# EasyEDA schematic Nakuja Power.json
TITLE: Sheet_1; REV: 1.0; Date: 2022-04-21; Sheet: 1/1; Drawn By: Rodney Osodo; Company: Your Company
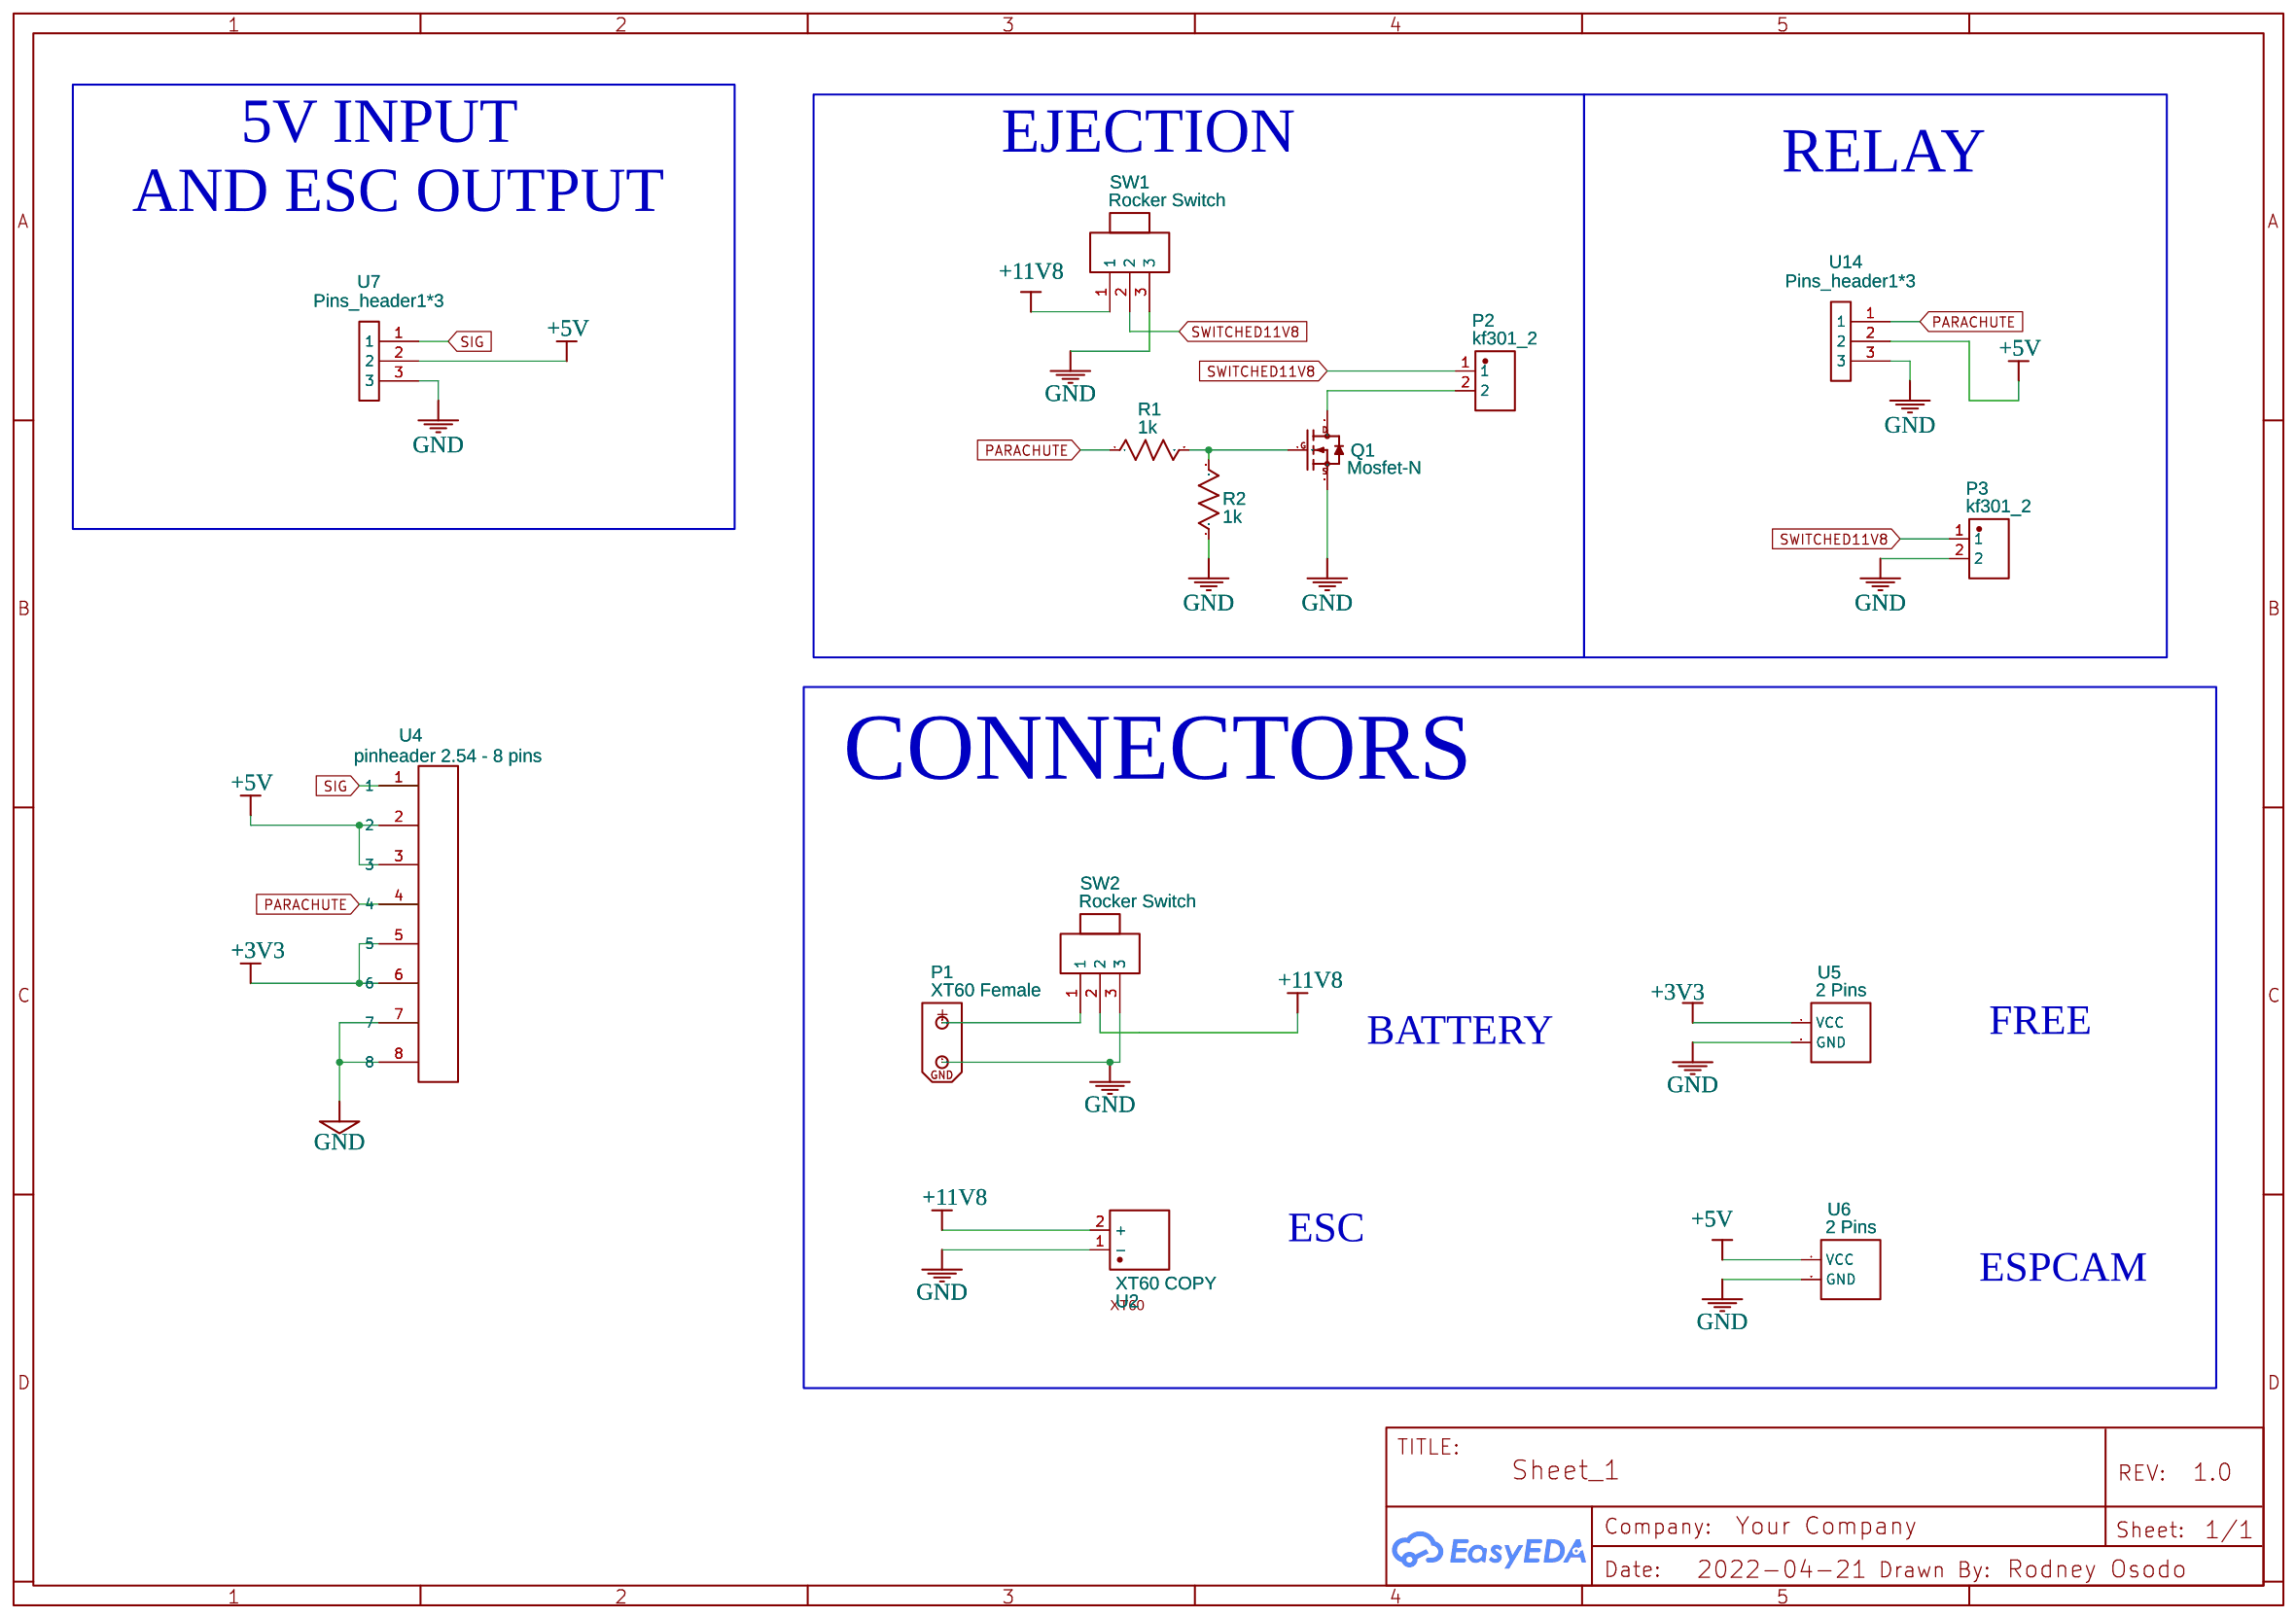
[diagram p0: schematic sheet]

## Parts
P1  XT60 Female  [XT60-F]
P2  kf301_2  [KF301_2P]
P3  kf301_2  [KF301_2P]
Q1  Mosfet-N  [DC-MOSFET-TO-220]
R1  1k  [R_AXIAL-0.6]
R2  1k  [R_AXIAL-0.6]
SW1  Rocker Switch  [ROCKER SWITCH TH]
SW2  Rocker Switch  [ROCKER SWITCH TH]
U2  XT60 COPY  [XT60]
U4  pinheader 2.54 - 8 pins  [PINHEADER 2.54 - 8 PINS]
U5  2 Pins  [2 PINS HEADER]
U6  2 Pins  [2 PINS HEADER]
U7  Pins_header1*3  [PINS_HEADER1*3]
U14  Pins_header1*3  [PINS_HEADER1*3]

## Library data of the parts
P1 = XT60 Female: Manufacturer: Changzhou Amass Elec; Contributor: rifanoz
P2 P3 = kf301_2: Manufacturer: BOOMELE; image: //image.lceda.cn/szlcsc/C33435.jpg; Supplier Part: C33435; Contributor: rusrobot
Q1 = Mosfet-N: Contributor: dina
R1 R2 = R_AXIAL-0.6_US: Contributor: LCEDA_Lib
SW1 SW2 = Rocker Switch: Mounted: Yes
U2 = XT60 COPY: Contributor: Mitian
U4 = pinheader 2.54 - 8 pins: Contributor: pramodsreelakam
U5 U6 = 2 Pins: Contributor: Uzain Yaseen
U7 U14 = Pins_header1*3: Contributor: Nattanan

## Nets
+3V3: U4.5 U4.6 U5.1(VCC)
+5V: U4.2 U4.3 U6.1(VCC) U7.2 U14.2
+11V8: SW1.1 SW2.2 U2.2(+)
GND: P1.1 P3.2 Q1.3(S) R2.1 SW1.3 SW2.3 U2.1(-) U4.7 U4.8 U5.2(GND) U6.2(GND) U7.3 U14.3
PARACHUTE: R1.1 U4.4 U14.1
SIG: U4.1 U7.1
SWITCHED11V8: P2.1 P3.1 SW1.2
Net-(P1-2): P1.2 SW2.1
Net-(P2-2): P2.2 Q1.2(D)
Net-(Q1-1): Q1.1(G) R1.2 R2.2

## Notes on the sheet
- 5V INPUT
- EJECTION
- RELAY
- AND ESC OUTPUT
- CONNECTORS
- BATTERY
- FREE
- ESC
- ESPCAM
